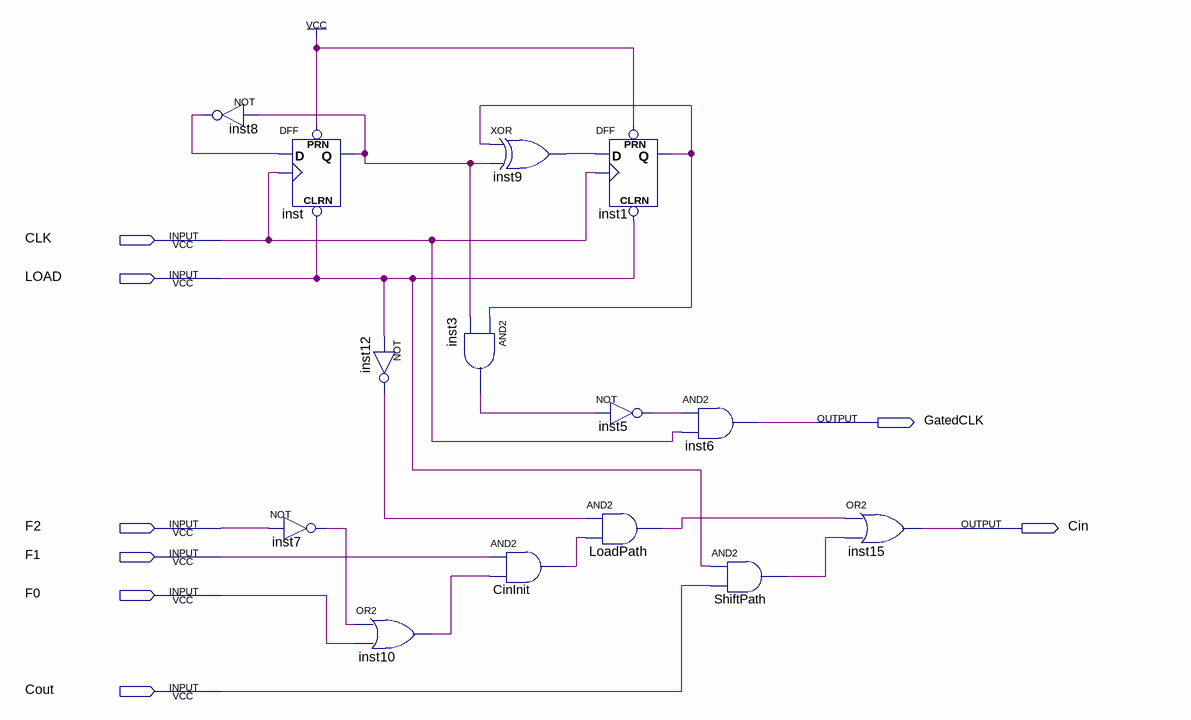
[diagram p0: schematic sheet]
// Quartus schematic Controller.bdf as structural Verilog: 14 symbols, 8 pins
module Controller (
  input  CLK,
  input  LOAD,
  input  F2,
  input  F1,
  input  F0,
  input  Cout,
  output GatedCLK,
  output Cin
);

  wire CinInit_out, inst1_q, inst3_out, inst5_out, inst7_out, inst8_out, inst9_out, inst10_out, inst12_out,
       inst_q, LoadPath_out, ShiftPath_out;

  not inst8 (inst8_out, inst_q);
  DFF inst (.CLRN(LOAD), .CLK(CLK), .D(inst8_out), .PRN(1'b1), .Q(inst_q));
  not inst7 (inst7_out, F2);
  not inst12 (inst12_out, LOAD);
  or inst10 (inst10_out, inst7_out, F0);
  xor inst9 (inst9_out, inst1_q, inst_q);
  and inst3 (inst3_out, inst1_q, inst_q);
  and CinInit (CinInit_out, F1, inst10_out);
  DFF inst1 (.CLRN(LOAD), .CLK(CLK), .D(inst9_out), .PRN(1'b1), .Q(inst1_q));
  not inst5 (inst5_out, inst3_out);
  and LoadPath (LoadPath_out, inst12_out, CinInit_out);
  and inst6 (GatedCLK, inst5_out, CLK);
  and ShiftPath (ShiftPath_out, LOAD, Cout);
  or inst15 (Cin, LoadPath_out, ShiftPath_out);
endmodule
